# Altium schematic sheet Diagram_Signal.SchDoc
size A
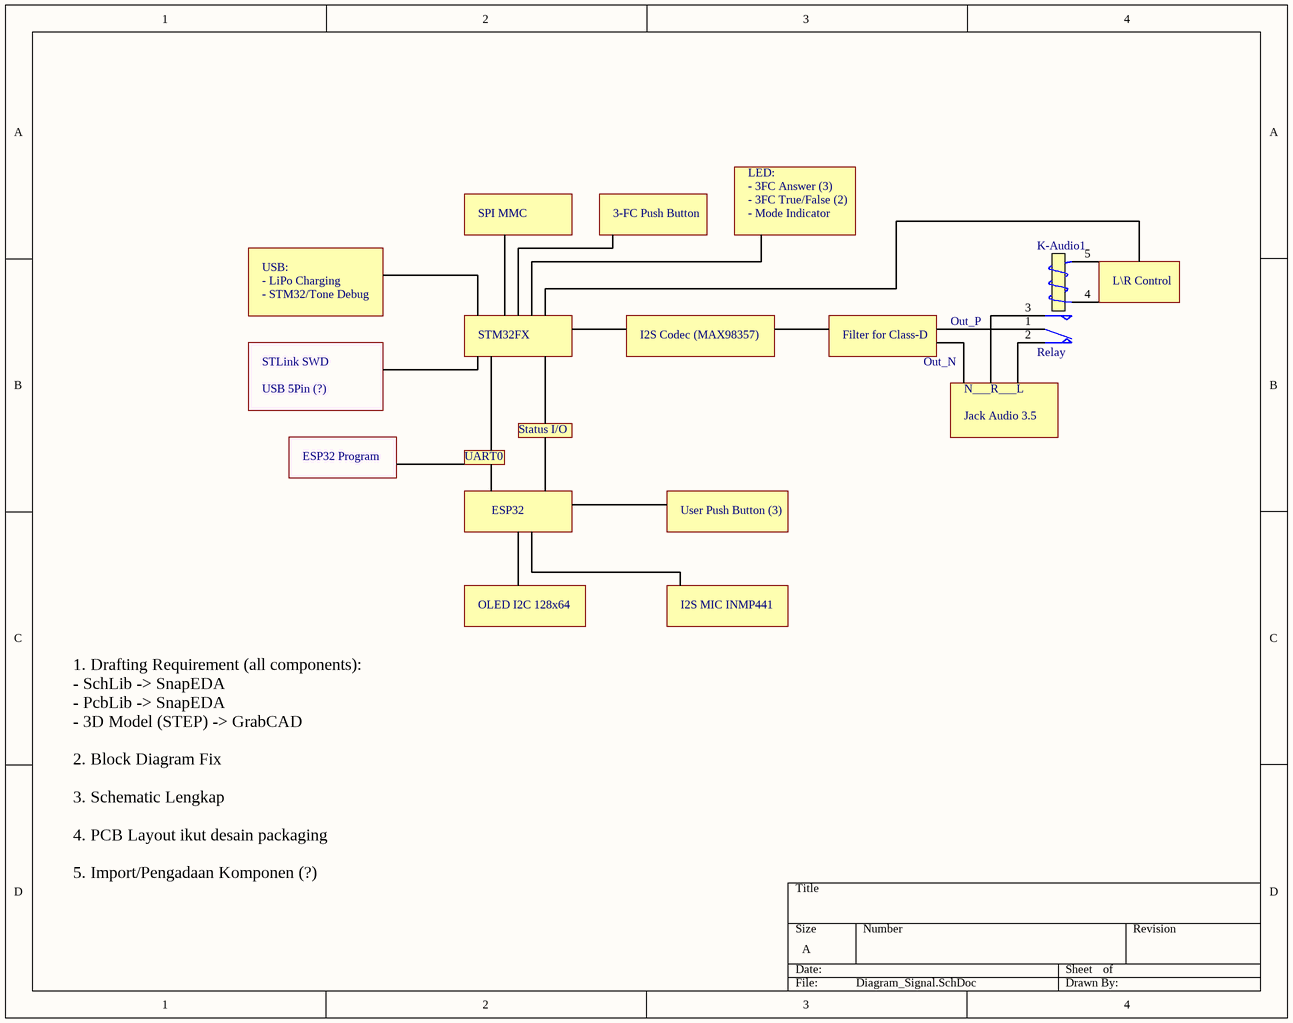
[diagram p0: Diagram_Signal.SchDoc]

## Parts
K-Audio1  Relay  [MODULE5B]

## Nets

Not connected (* = marked no-connect by the designer): K-Audio1 1(COM) 2(NC) 3(NO) 4(T1) 5(T2)

## Notes on the sheet
- SPI MMC
- 3-FC Push Button
- LED:
- - 3FC Answer (3)
- - 3FC True/False (2)
- - Mode Indicator
- USB:
- - LiPo Charging
- - STM32/Tone Debug
- (near K-Audio1) L\R Control
- STLink SWD
- STM32FX
- I2S Codec (MAX98357)
- Filter for Class-D
- Out_N
- Out_P
- USB 5Pin (?)
- Status I/O
- Jack Audio 3.5
- (near K-Audio1) N___R___L
- ESP32 Program
- UART0
- ESP32
- User Push Button (3)
- OLED I2C 128x64
- I2S MIC INMP441
- 1. Drafting Requirement (all components):
  - SchLib -> SnapEDA
  - PcbLib -> SnapEDA
  - 3D Model (STEP) -> GrabCAD
  2. Block Diagram Fix
  3. Schematic Lengkap
  4. PCB Layout ikut desain packaging
  5. Import/Pengadaan Komponen (?)

## Library data of the parts
K-Audio1 = Relay: SPDT Relay; Published: 8-Jun-2000; LatestRevisionDate: 17-Jul-2002; LatestRevisionNote: Re-released for DXP Platform.; PackageReference: MODULE5B; Publisher: Altium Limited